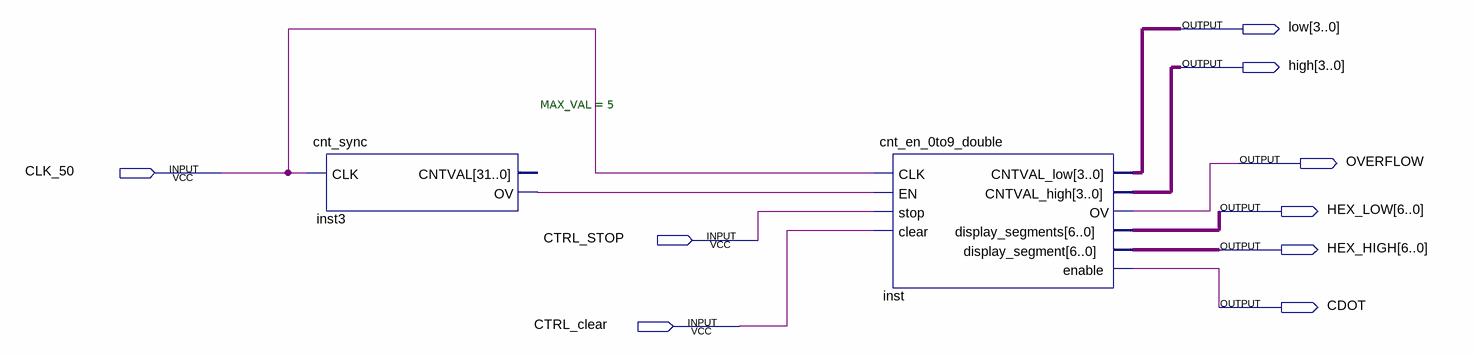
[diagram p0: schematic sheet]
// Quartus schematic TIM_CNT.bdf as structural Verilog: 2 symbols, 9 pins
module TIM_CNT (
  input  CLK_50,
  input  CTRL_STOP,
  input  CTRL_clear,
  output [3:0] low,
  output [3:0] high,
  output OVERFLOW,
  output [6:0] HEX_LOW,
  output [6:0] HEX_HIGH,
  output CDOT
);

  wire inst3_ov;

  cnt_sync #(.MAX_VAL(5)) inst3 (.CLK(CLK_50), .OV(inst3_ov));  // open: CNTVAL
  cnt_en_0to9_double inst (
    .CLK(CLK_50), .EN(inst3_ov), .stop(CTRL_STOP), .clear(CTRL_clear), .CNTVAL_low(low), .CNTVAL_high(high),
    .OV(OVERFLOW), .display_segments(HEX_LOW), .display_segment(HEX_HIGH), .enable(CDOT));
endmodule
